# Altium schematic sheet H204_R_MCUs.SchDoc: H204 - MCUs (part 1 of 2)
size A2; SheetNumber: 1; SheetTotal: 3; PageSetup: Record=PageOptions|CenterHorizontal=True|CenterVertical=True|PrintScale=0.63|XCorrection=1.00|YCorrection=1.00|PrintKind=0|BorderSize=5000000|LeftOffset=0|BottomOffset=0|Orientation=2|PaperLength=2794|PaperWidth=4318|Scale=100|PaperSource=7|PrintQuality=600|MediaType=1|DitherType=10|PaperKind=Legal (8 ½ x 14 in)|PrintScaleMode=1
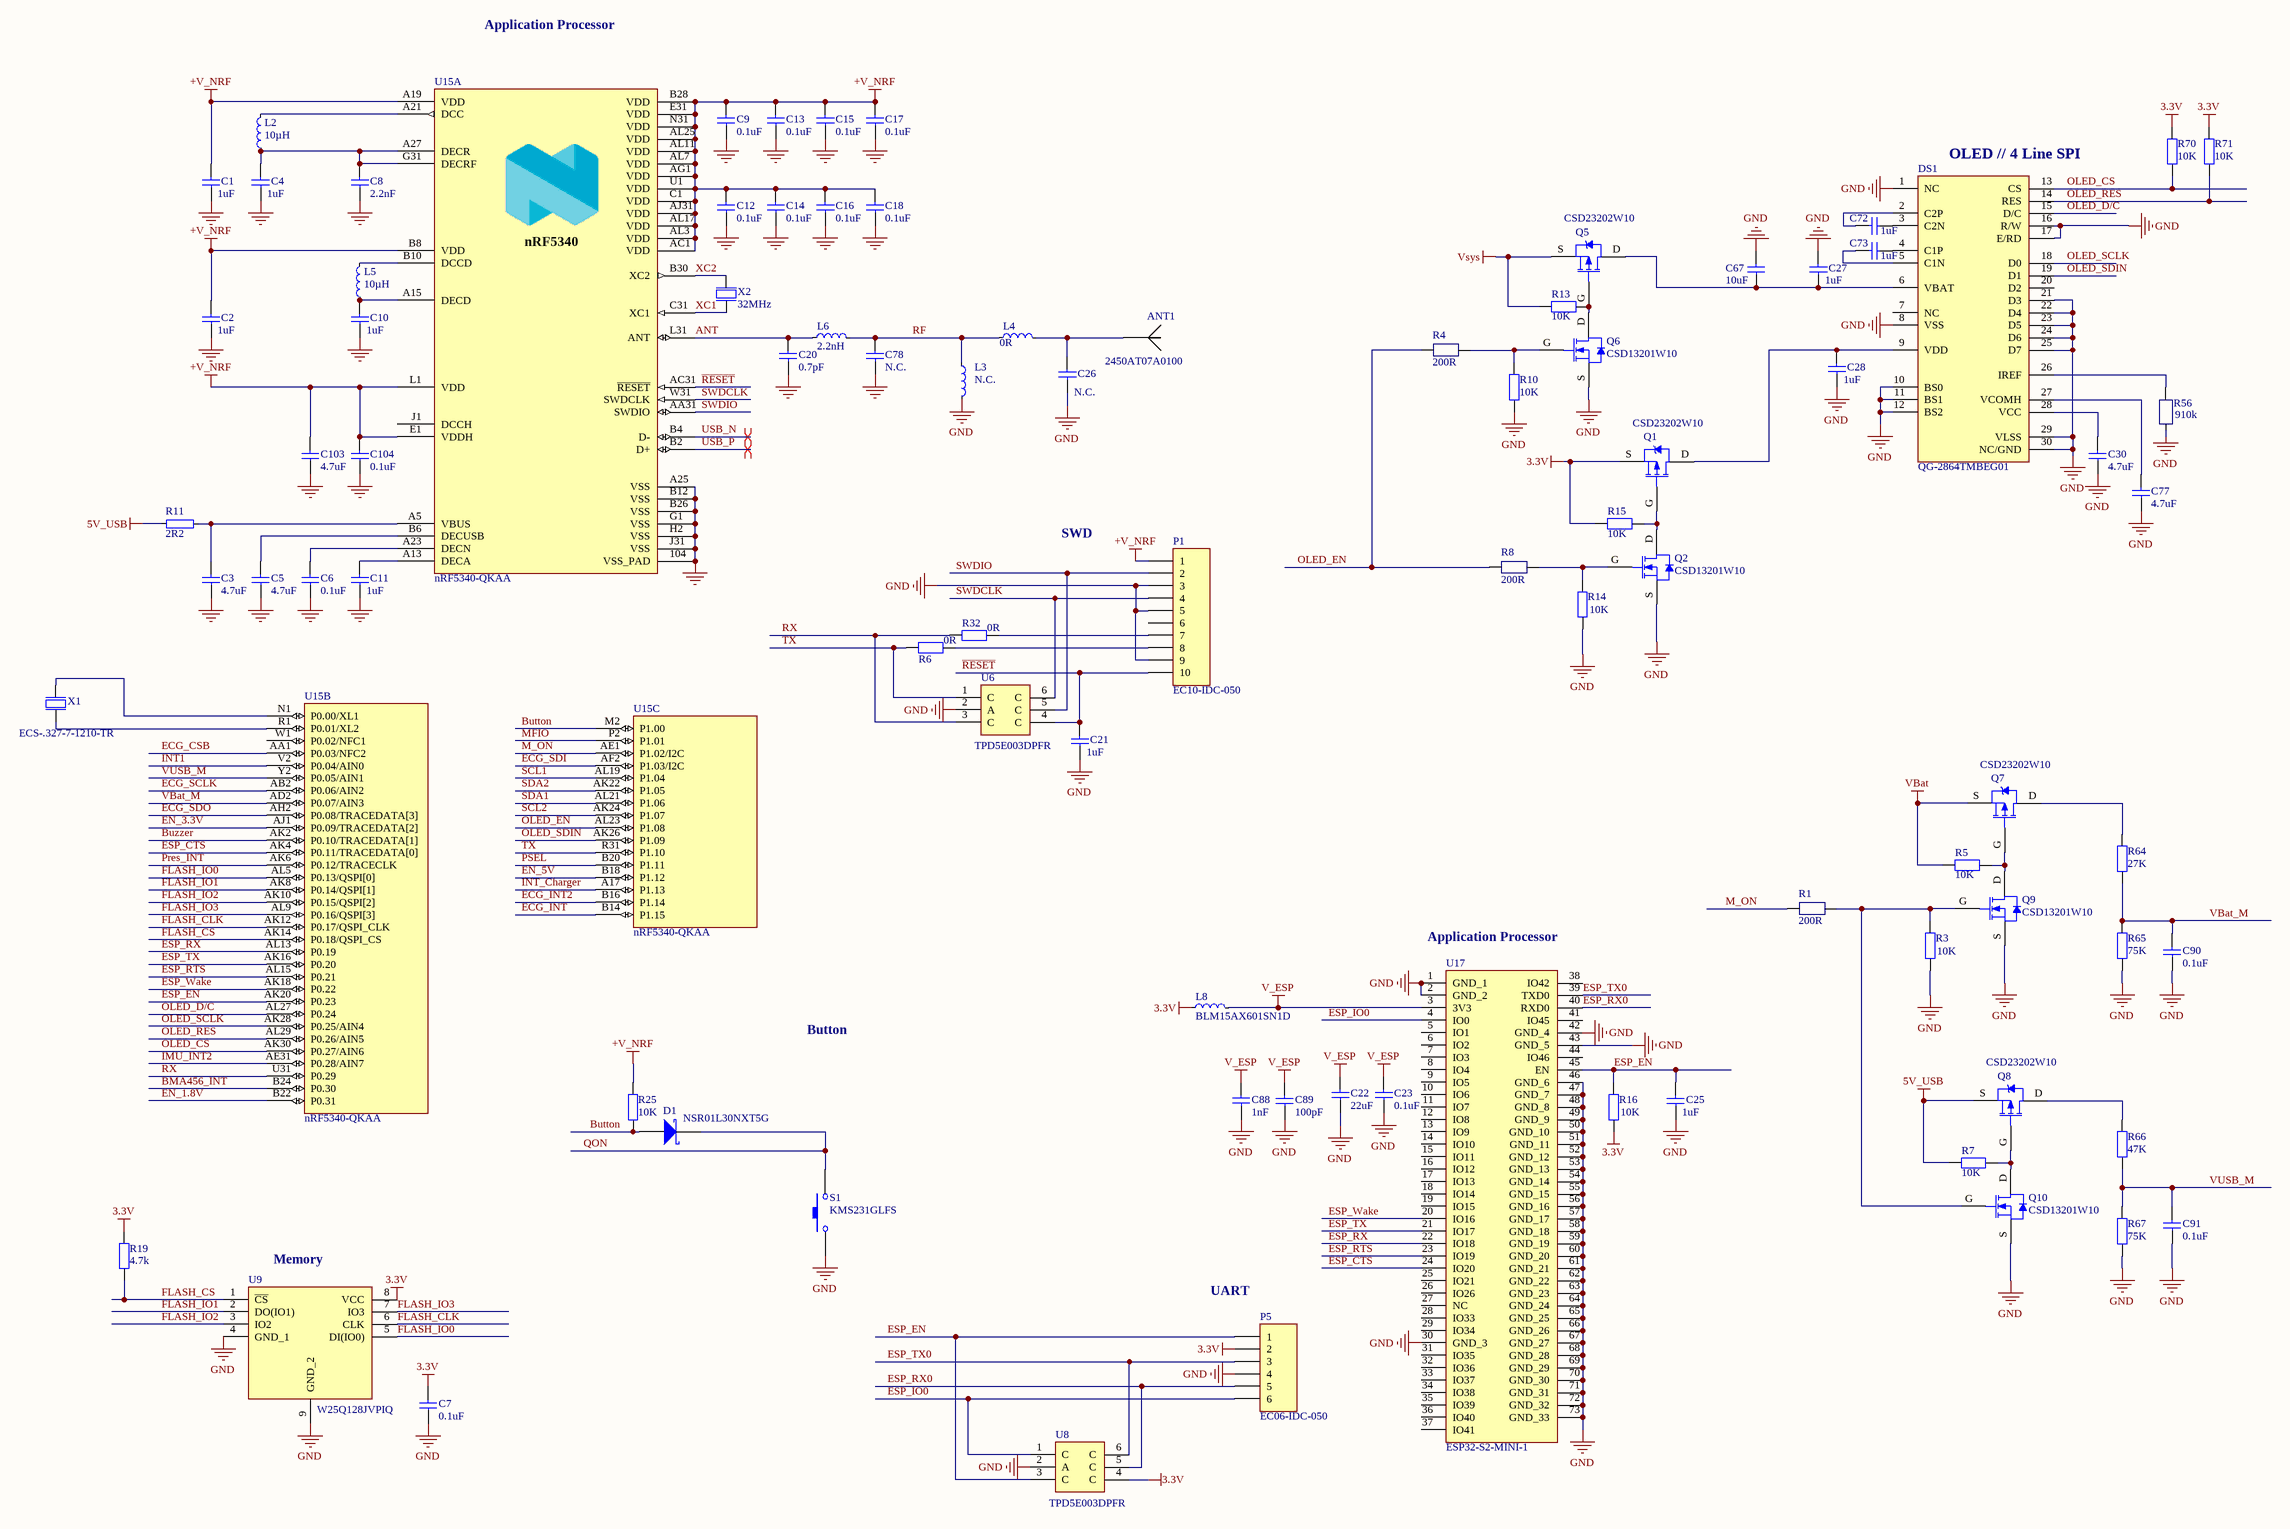
[diagram p0: H204_R_MCUs.SchDoc]

## Parts
ANT1  2450AT07A0100  [2450AT07A0100]
C1  1uF  [CAPC0603X33N]
C2  1uF  [CAPC0603X33N]
C3  4.7uF  [CAPC1005X55N]
C4  1uF  [CAPC0603X33N]
C5  4.7uF  [CAPC1005X55N]
C6  0.1uF  [CAPC0603X33N]
C7  0.1uF  [CAPC0603X33N]
C8  2.2nF  [CAPC0603X33N]
C9  0.1uF  [CAPC0603X33N]
C10  1uF  [CAPC0603X33N]
C11  1uF  [CAPC0603X33N]
C12  0.1uF  [CAPC0603X33N]
C13  0.1uF  [CAPC0603X33N]
C14  0.1uF  [CAPC0603X33N]
C15  0.1uF  [CAPC0603X33N]
C16  0.1uF  [CAPC0603X33N]
C17  0.1uF  [CAPC0603X33N]
C18  0.1uF  [CAPC0603X33N]
C20  0.7pF  [CAPC0603X33N]
C21  1uF  [CAPC0603X33N]
C22  22uF  [CAPC1005X55N]
C23  0.1uF  [CAPC0603X33N]
C25  1uF  [CAPC0603X33N]
C26  N.C.  [CAPC0603X33N]
C27  1uF  [CAPC0603X33N]
C28  1uF  [CAPC0603X33N]
C30  4.7uF  [CAPC1005X55N]
C67  10uF  [CAPC1005X55N]
C72  1uF  [CAPC0603X33N]
C73  1uF  [CAPC0603X33N]
C77  4.7uF  [CAPC1005X55N]
C78  N.C.  [CAPC0603X33N]
C88  1nF  [CAPC0603X33N]
C89  100pF  [CAPC0603X33N]
C90  0.1uF  [CAPC0603X33N]
C91  0.1uF  [CAPC0603X33N]
C103  4.7uF  [CAPC1005X55N]
C104  0.1uF  [CAPC0603X33N]
D1  NSR01L30NXT5G  [NSR01L30NXT5G]
DS1  QG-2864TMBEG01  [QG-2864TMBEG01]
L2  10µH  [INDC1608X100N]
L3  N.C.  [INDC0603X33N]
L4  0R  [INDC0603X33N]
L5  10µH  [INDC1608X100N]
L6  2.2nH  [INDC0603X33N]
L8  BLM15AX601SN1D  [INDC1005X55N]
P1  EC10-IDC-050  [EC10-IDC-050]
P5  EC06-IDC-050  [EC06-IDC-050]
Q1  CSD23202W10  [4-UFBGA]
Q2  CSD13201W10  [CSD13201W10]
Q5  CSD23202W10  [4-UFBGA]
Q6  CSD13201W10  [CSD13201W10]
Q7  CSD23202W10  [4-UFBGA]
Q8  CSD23202W10  [4-UFBGA]
Q9  CSD13201W10  [CSD13201W10]
Q10  CSD13201W10  [CSD13201W10]
R1  200R  [RESC0603X26N]
R3  10k  [RESC0603X26N]
R4  200R  [RESC0603X26N]
R5  10k  [RESC0603X26N]
R6  0R  [RESC0603X26N]
R7  10k  [RESC0603X26N]
R8  200R  [RESC0603X26N]
R10  10k  [RESC0603X26N]
R11  2R2  [RESC0603X26N]
R13  10k  [RESC0603X26N]
R14  10k  [RESC0603X26N]
R15  10k  [RESC0603X26N]
R16  10k  [RESC0603X26N]
R19  4.7k  [RESC0603X26N]
R25  10k  [RESC0603X26N]
R32  0R  [RESC0603X26N]
R56  910k  [RESC0603X26N]
R64  27k  [RESC0603X26N]
R65  75k  [RESC0603X26N]
R66  47k  [RESC0603X26N]
R67  75k  [RESC0603X26N]
R70  10k  [RESC0603X26N]
R71  10k  [RESC0603X26N]
S1  KMS231GLFS  [KMS231GLFS]
U6  TPD5E003DPFR  [SON35P100X100X40-6N]
U8  TPD5E003DPFR  [SON35P100X100X40-6N]
U9  W25Q128JVPIQ  [SON127P500X600X80-9N]
U15  nRF5340-QKAA  [AQFN40P700X700X85_HS-99N]  (parts A,B,C of 3)
U17  ESP32-S2-MINI-1  [ESP32S2MINI1]
X1  ECS-.327-7-1210-TR  [XTAL_ECS-.327-7-1210-TR]
X2  32MHz  [OSC_XRCTD37M400FXQ50R0]

## Nets
3.3V: C7.1 L8.1 P5.2 Q1.S R15.2 R16.1 R19.1 R70.1 R71.1 U8.4(C) U9.8(VCC)
5V_USB: Q8.S R7.2 R11.1
+V_NRF: C1.1 C2.1 C9.1 C12.1 C13.1 C14.1 C15.1 C16.1 C17.1 C18.1 C103.1 C104.1 P1.1 R25.1 U15.A19(VDD) U15.AC1(VDD) U15.AG1(VDD) U15.AJ31(VDD) U15.AL3(VDD) U15.AL7(VDD) U15.AL11(VDD) U15.AL17(VDD) U15.AL25(VDD) U15.B8(VDD) U15.B28(VDD) U15.C1(VDD) U15.E1(VDDH) U15.E31(VDD) U15.L1(VDD) U15.N31(VDD) U15.U1(VDD)
GND: ANT1.2 C1.2 C2.2 C3.2 C4.2 C5.2 C6.2 C7.2 C8.2 C9.2 C10.2 C11.2 C12.2 C13.2 C14.2 C15.2 C16.2 C17.2 C18.2 C20.1 C21.2 C22.2 C23.2 C25.2 C26.1 C27.1 C28.2 C30.2 C67.1 C77.2 C78.1 C88.1 C89.2 C90.2 C91.2 C103.2 C104.2 DS1.1(NC) DS1.8(VSS) DS1.10(BS0) DS1.11(BS1) DS1.12(BS2) DS1.16(R/W) DS1.17(E/RD) DS1.21(D3) DS1.22(D4) DS1.23(D5) DS1.24(D6) DS1.25(D7) DS1.29(VLSS) DS1.30(NC/GND) L3.2 P1.3 P1.5 P1.9 P5.4 Q2.S Q6.S Q9.S Q10.S R3.1 R10.1 R14.1 R56.1 R65.2 R67.2 S1.1 U6.2(A) U8.2(A) U9.4(GND_1) U9.9(GND_2) U15.104(VSS_PAD) U15.A25(VSS) U15.B12(VSS) U15.B26(VSS) U15.G1(VSS) U15.H2(VSS) U15.J31(VSS) U17.1(GND_1) U17.2(GND_2) U17.30(GND_3) U17.42(GND_4) U17.43(GND_5) U17.46(GND_6) U17.47(GND_7) U17.48(GND_8) U17.49(GND_9) U17.50(GND_10) U17.51(GND_11) U17.52(GND_12) U17.53(GND_13) U17.54(GND_14) U17.55(GND_15) U17.56(GND_16) U17.57(GND_17) U17.58(GND_18) U17.59(GND_19) U17.60(GND_20) U17.61(GND_21) U17.62(GND_22) U17.63(GND_23) U17.64(GND_24) U17.65(GND_25) U17.66(GND_26) U17.67(GND_27) U17.68(GND_28) U17.69(GND_29) U17.70(GND_30) U17.71(GND_31) U17.72(GND_32) U17.73(GND_33) X2.2(GND) X2.4(GND)
V_ESP: C22.1 C23.1 C88.2 C89.1 L8.2 U17.3(3V3)
VBat: Q7.S R5.2
Vsys: Q5.S R13.2
ANT: C20.2 L6.2 U15.L31(ANT)
BMA456_INT: U15.B24(P0.30)
Button: D1.1(A) R25.2 U15.M2(P1.00)
Buzzer: U15.AK2(P0.10/TRACEDATA[1])
ECG_CSB: U15.AA1(P0.03/NFC2)
ECG_INT: U15.B14(P1.15)
ECG_INT2: U15.B16(P1.14)
ECG_SCLK: U15.AB2(P0.06/AIN2)
ECG_SDI: U15.AF2(P1.03/I2C)
ECG_SDO: U15.AH2(P0.08/TRACEDATA[3])
EN_1.8V: U15.B22(P0.31)
EN_3.3V: U15.AJ1(P0.09/TRACEDATA[2])
EN_5V: U15.B18(P1.12)
ESP_CTS: U15.AK4(P0.11/TRACEDATA[0]) U17.24(IO20)
ESP_EN: C25.1 P5.1 R16.2 U8.3(C) U15.AK20(P0.23) U17.45(EN)
ESP_IO0: P5.6 U8.1(C) U17.4(IO0)
ESP_RTS: U15.AL15(P0.21) U17.23(IO19)
ESP_RX: U15.AL13(P0.19) U17.22(IO18)
ESP_RX0: P5.5 U8.5(C) U17.40(RXD0)
ESP_TX: U15.AK16(P0.20) U17.21(IO17)
ESP_TX0: P5.3 U8.6(C) U17.39(TXD0)
ESP_Wake: U15.AK18(P0.22) U17.20(IO16)
FLASH_CLK: U9.6(CLK) U15.AK12(P0.17/QSPI_CLK)
FLASH_CS: R19.2 U9.1(~{CS}) U15.AK14(P0.18/QSPI_CS)
FLASH_IO0: U9.5(DI(IO0)) U15.AL5(P0.13/QSPI[0])
FLASH_IO1: U9.2(DO(IO1)) U15.AK8(P0.14/QSPI[1])
FLASH_IO2: U9.3(IO2) U15.AK10(P0.15/QSPI[2])
FLASH_IO3: U9.7(IO3) U15.AL9(P0.16/QSPI[3])
IMU_INT2: U15.AE31(P0.28/AIN7)
INT1: U15.V2(P0.04/AIN0)
INT_Charger: U15.A17(P1.13)
M_ON: R1.1 U15.AE1(P1.02/I2C)
MFIO: U15.P2(P1.01)
OLED_CS: DS1.13(CS) R70.2 U15.AK30(P0.27/AIN6)
OLED_D/C: DS1.15(D/C) U15.AL27(P0.24)
OLED_EN: R4.1 R8.1 U15.AL23(P1.08)
OLED_RES: DS1.14(RES) R71.2 U15.AL29(P0.26/AIN5)
OLED_SCLK: DS1.18(D0) U15.AK28(P0.25/AIN4)
OLED_SDIN: DS1.19(D1) U15.AK26(P1.09)
Pres_INT: U15.AK6(P0.12/TRACECLK)
PSEL: U15.B20(P1.11)
QON: D1.2(K) S1.2
~{RESET}: C21.1 P1.10 U6.4(C) U15.AC31(~{RESET})
RF: C78.2 L3.1 L4.1 L6.1
RX: R32.1 U6.3(C) U15.U31(P0.29)
SCL1: U15.AL19(P1.04)
SCL2: U15.AK24(P1.07)
SDA1: U15.AL21(P1.06)
SDA2: U15.AK22(P1.05)
SWDCLK: P1.4 U6.6(C) U15.W31(SWDCLK)
SWDIO: P1.2 U6.5(C) U15.AA31(SWDIO)
TX: R6.1 U6.1(C) U15.R31(P1.10)
USB_N: U15.B4(D-)
USB_P: U15.B2(D+)
VBat_M: C90.1 R64.2 R65.1 U15.AD2(P0.07/AIN3)
VUSB_M: C91.1 R66.2 R67.1 U15.Y2(P0.05/AIN1)
XC1: U15.C31(XC1) X2.1(inp)
XC2: U15.B30(XC2) X2.3(out)
NetANT1_1: ANT1.1 C26.2 L4.2
NetC3_1: C3.1 R11.2 U15.A5(VBUS)
NetC4_1: C4.1 C8.1 L2.1 U15.A27(DECR) U15.G31(DECRF)
NetC5_1: C5.1 U15.B6(DECUSB)
NetC6_1: C6.1 U15.A23(DECN)
NetC10_1: C10.1 L5.1 U15.A15(DECD)
NetC11_1: C11.1 U15.A13(DECA)
NetC27_2: C27.2 C67.2 DS1.6(VBAT) Q5.D
NetC28_1: C28.1 DS1.9(VDD) Q1.D
NetC30_1: C30.1 DS1.28(VCC)
NetC72_1: C72.1 DS1.3(C2N)
NetC72_2: C72.2 DS1.2(C2P)
NetC73_1: C73.1 DS1.4(C1P)
NetC73_2: C73.2 DS1.5(C1N)
NetC77_1: C77.1 DS1.27(VCOMH)
NetDS1_26: DS1.26(IREF) R56.2
NetL2_2: L2.2 U15.A21(DCC)
NetL5_2: L5.2 U15.B10(DCCD)
NetP1_7: P1.7 R32.2
NetP1_8: P1.8 R6.2
NetQ1_G: Q1.G Q2.D R15.1
NetQ2_G: Q2.G R8.2 R14.2
NetQ5_G: Q5.G Q6.D R13.1
NetQ6_G: Q6.G R4.2 R10.2
NetQ7_D: Q7.D R64.1
NetQ7_G: Q7.G Q9.D R5.1
NetQ8_D: Q8.D R66.1
NetQ8_G: Q8.G Q10.D R7.1
NetQ9_G: Q9.G Q10.G R1.2 R3.2
NetU15_N1: U15.N1(P0.00/XL1) X1.1(inp)
NetU15_R1: U15.R1(P0.01/XL2) X1.2(out)

Not connected (* = marked no-connect by the designer): DS1 7(NC) 20(D2); P1 6; U15 AG31(N.C.) D2(N.C.) F2(N.C.) J1(DCCH) T2(N.C.) W1(P0.02/NFC1); U17 5(IO1) 6(IO2) 7(IO3) 8(IO4) 9(IO5) 10(IO6) 11(IO7) 12(IO8) 13(IO9) 14(IO10) 15(IO11) 16(IO12) 17(IO13) 18(IO14) 19(IO15) 25(IO21) 26(IO26) 27(NC) 28(IO33) 29(IO34) 31(IO35) 32(IO36) 33(IO37) 34(IO38) 35(IO39) 36(IO40) 37(IO41) 38(IO42) 41(IO45) 44(IO46)

## Layout directives
differential pair: USB_N, USB_P

## Notes on the sheet
- Application Processor
- (near DS1) OLED // 4 Line SPI
- SWD
- (near U17) Application Processor
- Button
- (near U9) Memory
- (near P5) UART
- Title
- Size:
- Date:
- File:
- A2
- Number:
- Time:
- Revision:
- Sheet
- of
- (in symbol nRF5340-QKAA, part A) nRF5340